# EAGLE design NEO_Board_V2 (EAGLE 7.6.0)
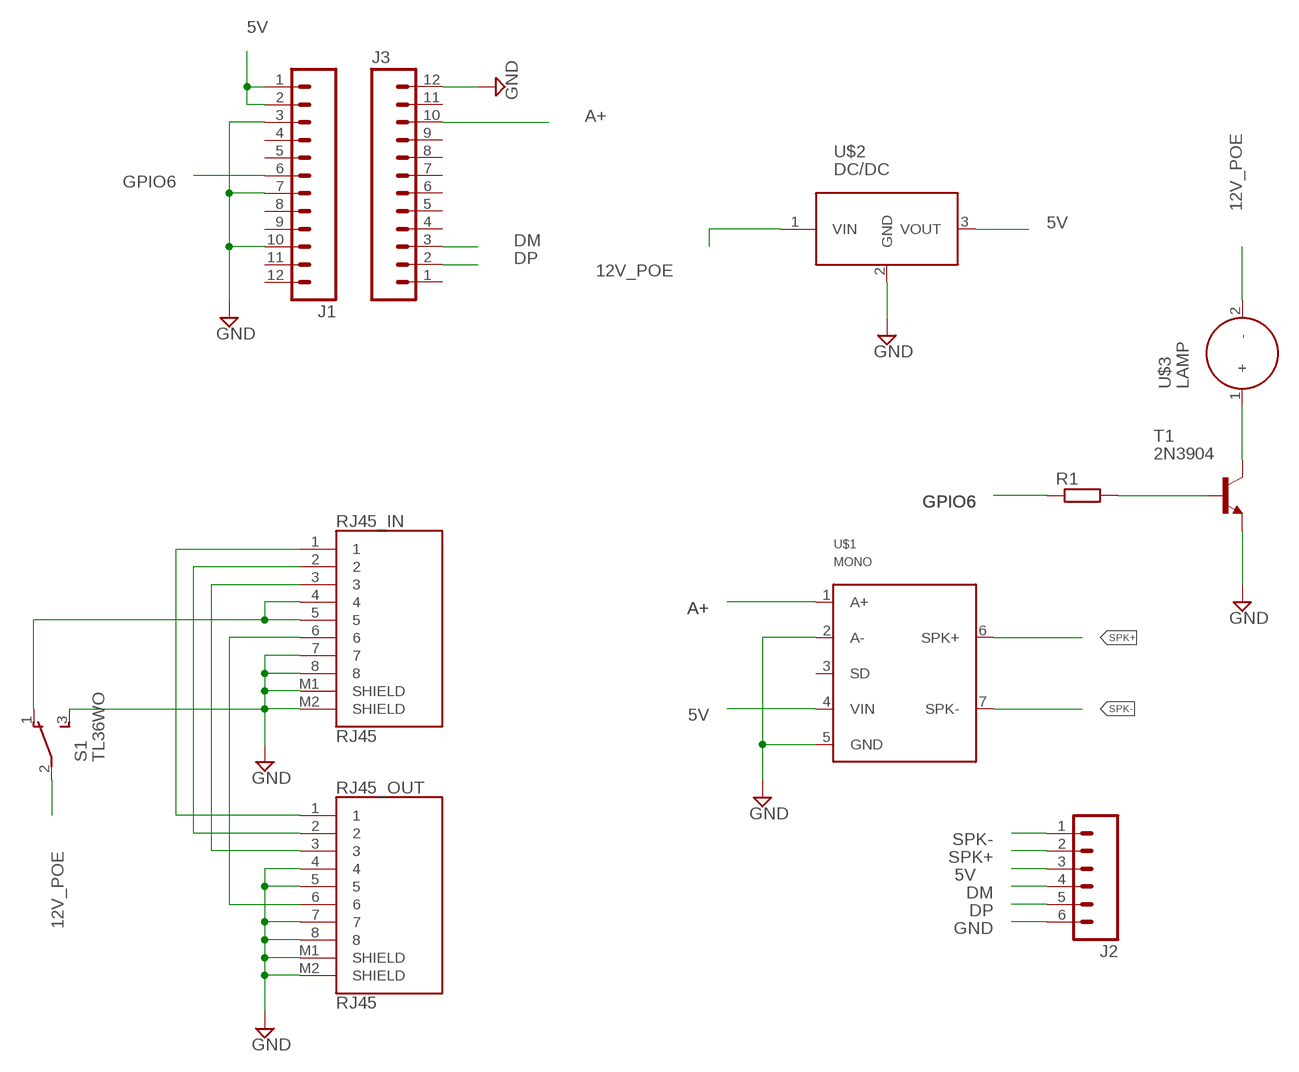
[diagram p0: schematic, sheet 1]

## Parts
J1  M12PTH  [1X12]
J2  M06NO_SILK_FEMALE_PTH  [1X06_NO_SILK]
J3  M12PTH  [1X12]
R1  R-EU_0207/10  [0207/10]
RJ45_IN  RJ45  [RJ45]
RJ45_OUT  RJ45  [RJ45]
S1  TL36WO  [TL3XWO]
T1  2N3904  [TO92]
U$1  MONO  [MONO_AMP]
U$2  DC/DC  [DC/DC]
U$3  LAMP  [LAMP]

## Nets
5: RJ45_IN.4 RJ45_IN.5 S1.1(O)
5V: J1.1 J1.2 J2.3 U$1.4(VIN) U$2.3(VOUT)
12V_POE: S1.2(P) U$2.1(VIN) U$3.2(-)
A+: J3.10 U$1.1(A+)
DM: J2.4 J3.3
DP: J2.5 J3.2
GND: J1.3 J1.7 J1.10 J2.6 J3.12 RJ45_IN.7 RJ45_IN.8 RJ45_IN.M1(SHIELD) RJ45_IN.M2(SHIELD) RJ45_OUT.4 RJ45_OUT.5 RJ45_OUT.7 RJ45_OUT.8 RJ45_OUT.M1(SHIELD) RJ45_OUT.M2(SHIELD) S1.3(S) T1.3(E) U$1.2(A-) U$1.5(GND) U$2.2(GND)
GPIO6: J1.6 R1.1
N$1: R1.2 T1.2(B)
N$2: RJ45_IN.6 RJ45_OUT.6
N$3: T1.1(C) U$3.1(+)
N$4: RJ45_IN.3 RJ45_OUT.3
N$7: RJ45_IN.2 RJ45_OUT.2
N$9: RJ45_IN.1 RJ45_OUT.1
SPK+: J2.2 U$1.6(SPK+)
SPK-: J2.1 U$1.7(SPK-)
Unconnected: J1.4 J1.5 J1.8 J1.9 J1.11 J1.12 J3.1 J3.4 J3.5 J3.6 J3.7 J3.8 J3.9 J3.11 U$1.3(SD)

## Library data of the parts
J1 J3 = SparkFun-Connectors:M12: Header 12 Standard 12-pin 0.1" header. Use with straight break away headers (SKU : PRT-00116), right angle break away headers (PRT-00553), swiss pins (PRT-00743), machine pins (PRT-00117), and female headers (PRT-00115).
J2 = SparkFun-Connectors:M06: Header 6 Standard 6-pin 0.1" header. Use with straight break away headers (SKU : PRT-00116), right angle break away headers (PRT-00553), swiss pins (PRT-00743), machine pins (PRT-00117), and female headers (PRT-00115). Molex polarized connector foot print use with SKU : PRT-08094 with associated crimp pins and housings. NOTES ON THE VARIANTS LOCK and LOCK_LONGPADS... This footprint was designed to help hold the alignment of a through-hole component (i.e. 6-pin header) while soldering it into place. You may notice that each hole has been shifted either up or down by 0.005 of an inch from it's more standard position (which is a perfectly straight line). This slight alteration caused the pins (the squares in the middle) to touch the edges of the holes. Because they are alternating, it causes a "brace" to hold the component in place. 0.005 has proven to be the perfect amount of "off-center" position when using our standard breakaway headers. Although looks a little odd when you look at the bare footprint, once you have a header in there, the alteration is very hard to notice. Also,if you push a header all the way into place, it is covered up entirely on the bottom side. This idea of altering the position of holes to aid alignment will be further integrated into the Sparkfun Library for other footprints. It can help hold any component with 3 or more connection pins.; PROD_ID: CONN-08437
R1 = rcl:R-EU_: RESISTOR, European symbol
RJ45_IN RJ45_OUT = DWhisper:RJ45
S1 = switch:TL36WO: TINY SWITCH ON - ON Source: http://www2.produktinfo.conrad.com/datenblaetter/700000-724999/705152-da-01-de-Subminiaturschalter_TL_36WO.pdf
T1 = transistor:2N3904: NPN TRANSISTOR
U$1 = DWhisper:MONO
U$2 = DWhisper:DC/DC
U$3 = DWhisper:LAMP

## Board
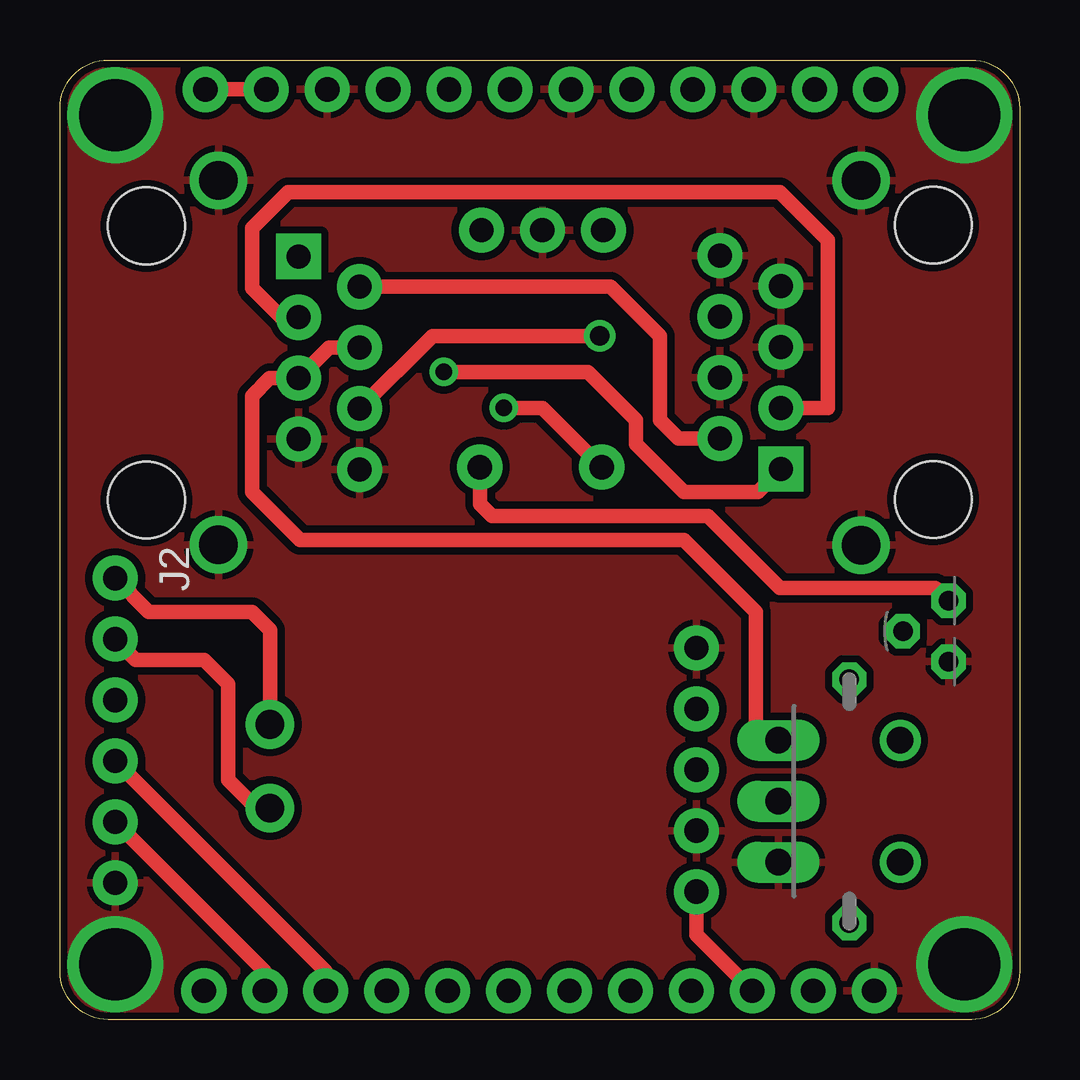
[diagram p1: board, top side]
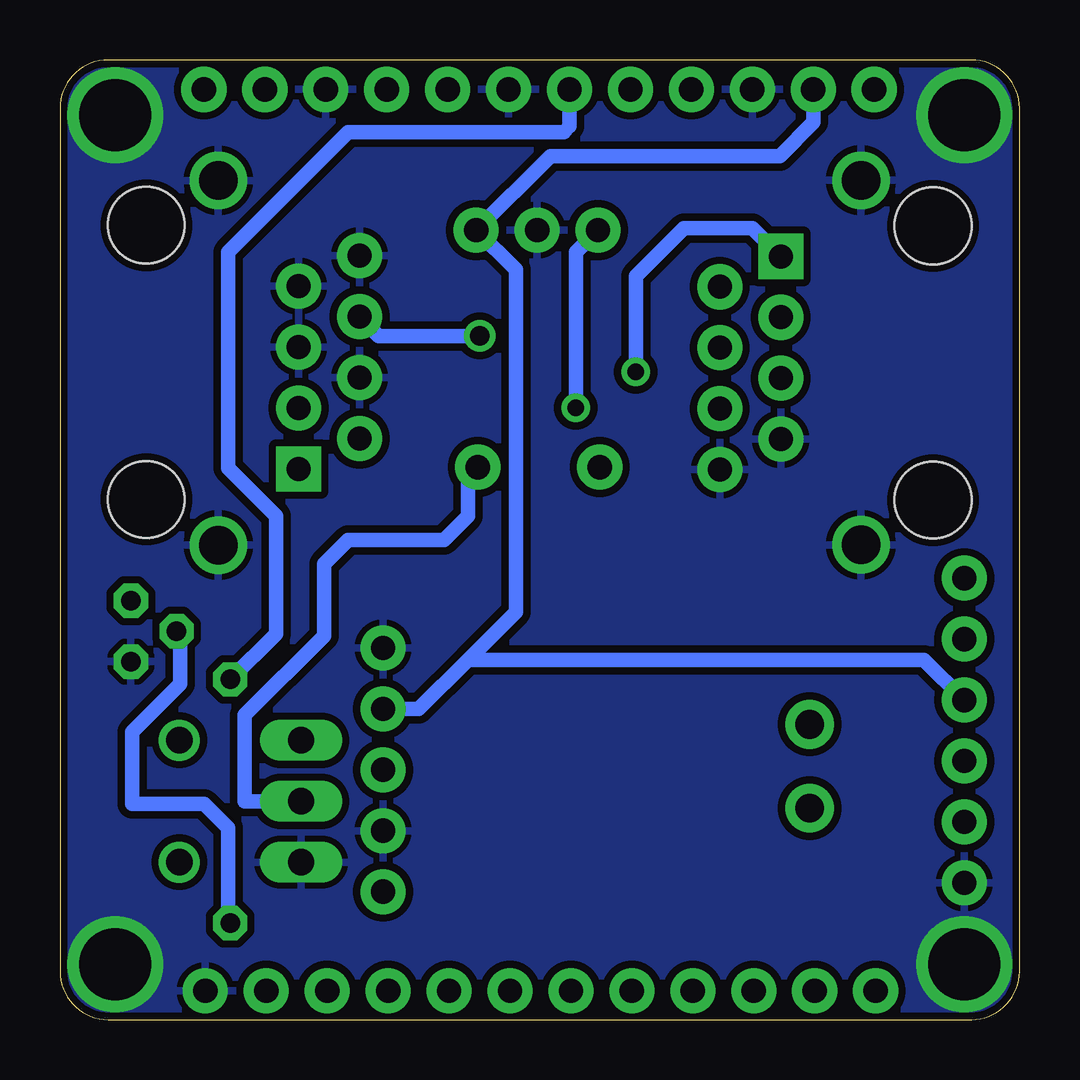
[diagram p2: board, bottom side, seen from below]

Size 40 x 40 mm. Coordinates in mm from the lower left corner, seen from the top.
Outline: 40,38 40,2 arc-90 38,0 2,0 arc-90 0,2 0,38 arc-90 2,40 38,40 arc-90 40,38
Copper layers (1*16): Top 0.035mm / dielectric 1.5mm / Bottom 0.035mm
Design rules "SparkFun": minimum track width 8mil, minimum drill 20mil, track to track 8mil, track to pad 8mil, pad to pad 8mil, via to via 8mil, smd to smd 8mil, copper to edge 10mil, drill to drill 8mil, minimum pad ring 12mil, minimum via ring 10mil, stop-mask expansion 4mil, vias tented up to drill 25mil, thermal gap 10mil

### Footprints (pad centres in the part's own frame; a part is rotated, then mirrored left to right if it is on the bottom)
1X12 = drill 1.016 pad 1.88: 1 0,0; 2 2.54,0; 3 5.08,0; 4 7.62,0; 5 10.16,0; 6 12.7,0; 7 15.24,0; 8 17.78,0; 9 20.32,0; 10 22.86,0; 11 25.4,0; 12 27.94,0
1X06_NO_SILK = drill 1.016 pad 1.88: 1 0,0; 2 2.54,0; 3 5.08,0; 4 7.62,0; 5 10.16,0; 6 12.7,0
0207/10 = drill 0.813 octagon: 1 -5.08,0; 2 5.08,0
RJ45 = drill 1 pad 1.88 square: 1 4.445,8.555 | drill 1 pad 1.88: 2 5.715,11.095; 3 6.985,8.555; 4 8.255,11.095; 5 9.525,8.555; 6 10.795,11.095; 7 12.065,8.555; 8 13.335,11.095 | drill 1.6 pad 2.184: M1 1.27,5.21; M2 16.47,5.21 | hole 3.2: 3.175,2.205; 14.605,2.205
TL3XWO = drill 1.1 pad 1.422 long: 1 -2.54,-5.08; 2 0,-5.08; 3 2.54,-5.08 | drill 1.1 pad 1.676: M1 -2.54,0; M2 2.54,0
TO92 = drill 0.813 octagon: 1 1.27,0; 2 0,1.905; 3 -1.27,0
MONO_AMP = drill 1.016 pad 1.88: 1 2.54,12.7; 2 2.54,10.16; 3 2.54,7.62; 4 2.54,5.08; 5 2.54,2.54 | drill 1.2 pad 2.032: 6 20.32,9.215; 7 20.32,5.723
DC/DC = drill 1.016 pad 1.88: 1 4.166,7.493; 2 4.166,4.953; 3 4.166,2.413
LAMP = drill 1.016 pad 1.88: 1 1.486,6.071; 2 6.566,6.071

### Placement (x,y rotation side)
J1  6.06,38.77 0 top
J2  2.3,18.4 270 top
J3  6,1.2 0 top
R1  32.9,9.1 270 top
RJ45_IN  1.4,36.26 270 top
RJ45_OUT  38.61,18.51 90 top
S1  35.03,9.1 270 top
T1  37.04,16.19 90 top
U$1  29.07,18.03 180 top
U$2  25.06,28.74 90 top
U$3  16.02,16.96 0 top

### Tracks (layer width: path | path; a pad name or v marks a point on that pad's centre or on a via)
5
  Top 0.61: RJ45_IN.4 11.22,28 RJ45_IN.5 8.73,26.73 8,26 8,22 10,20 26,20 29,17 29,11.64 S1.1
5V
  Top 0.61: J1.1 J1.2
  Bottom 0.61: J1.2 8.6,37.4 10,36 19.56,36 U$2.3 21,31.25 21,17 23,15 | U$1.4 25.05,12.95 23,15 | J2.3 3.98,15 23,15
12V_POE  (via drill 0.7)
  Top 0.61: v18.5,25.5 20.11,25.5 U$3.2
  Bottom 0.61: U$2.1 17.59,32.91 18.5,32 v18.5,25.5 | S1.2 32.3,9.1 32.3,12.7 29,16 29,19 28,20 24,20 23,21 23,22.61 U$3.2
A+
  Top 0.61: U$1.1 26.53,3.53 J3.10
DM
  Top 0.61: J2.4 11.08,2 J3.3
DP
  Top 0.61: J2.5 8.54,2 J3.2
GND  (via drill 3)
  other vias: 2.3,37.7 2.3,2.3 37.7,2.3 37.7,37.7
  pour Top (isolate 0.305): 0,38 0,2 arc90 2,0 38,0 arc90 40,2 40,38 arc90 38,40 2,40 arc90
  pour Bottom (isolate 0.305): 0,38 0,2 arc90 2,0 38,0 arc90 40,2 40,38 arc90 38,40 2,40 arc90
GPIO6
  Bottom 0.61: R1.1 31,16.08 31,21 33,23 33,32 28,37 19,37 18.76,37.24 J1.6
N$1
  Bottom 0.61: R1.2 33,4.12 33,8 34,9 37,9 37,12 35,14 35,16.05 arc-90 T1.2
N$2  (via drill 0.8)
  Top 0.61: RJ45_IN.6 15.53,28.5 v22.5,28.5
  Bottom 0.61: v22.5,28.5 26.71,28.5 RJ45_OUT.6
N$3
  Top 0.61: U$3.1 17.5,21.5 18,21 27,21 30,18 36.5,18 T1.1
N$4
  Top 0.61: RJ45_IN.3 9.23,29.27 8,30.5 8,33 9.5,34.5 30,34.5 32,32.5 32,25.5 RJ45_OUT.3
N$7
  Top 0.61: RJ45_IN.2 22.96,30.54 25,28.5 25,25 25.78,24.22 RJ45_OUT.2
N$9  (via drill 0.7)
  Top 0.61: v16,27 22,27 24,25 24,24 26,22 29.1,22 RJ45_OUT.1
  Bottom 0.61: RJ45_IN.1 11.14,33 14,33 16,31 v16,27
SPK+
  Top 0.61: J2.2 3.16,15 6,15 7,14 7,10 8.19,8.81 U$1.6
SPK-
  Top 0.61: J2.1 3.7,17 8,17 8.75,16.25 U$1.7